# EasyEDA schematic Easy EDA - Maltron_S_Edition - Schematic.json
TITLE: Maltron_S_Edition; REV: 1.0; Date: 2022-05-24; Sheet: 1/1; Company: MindrustUK
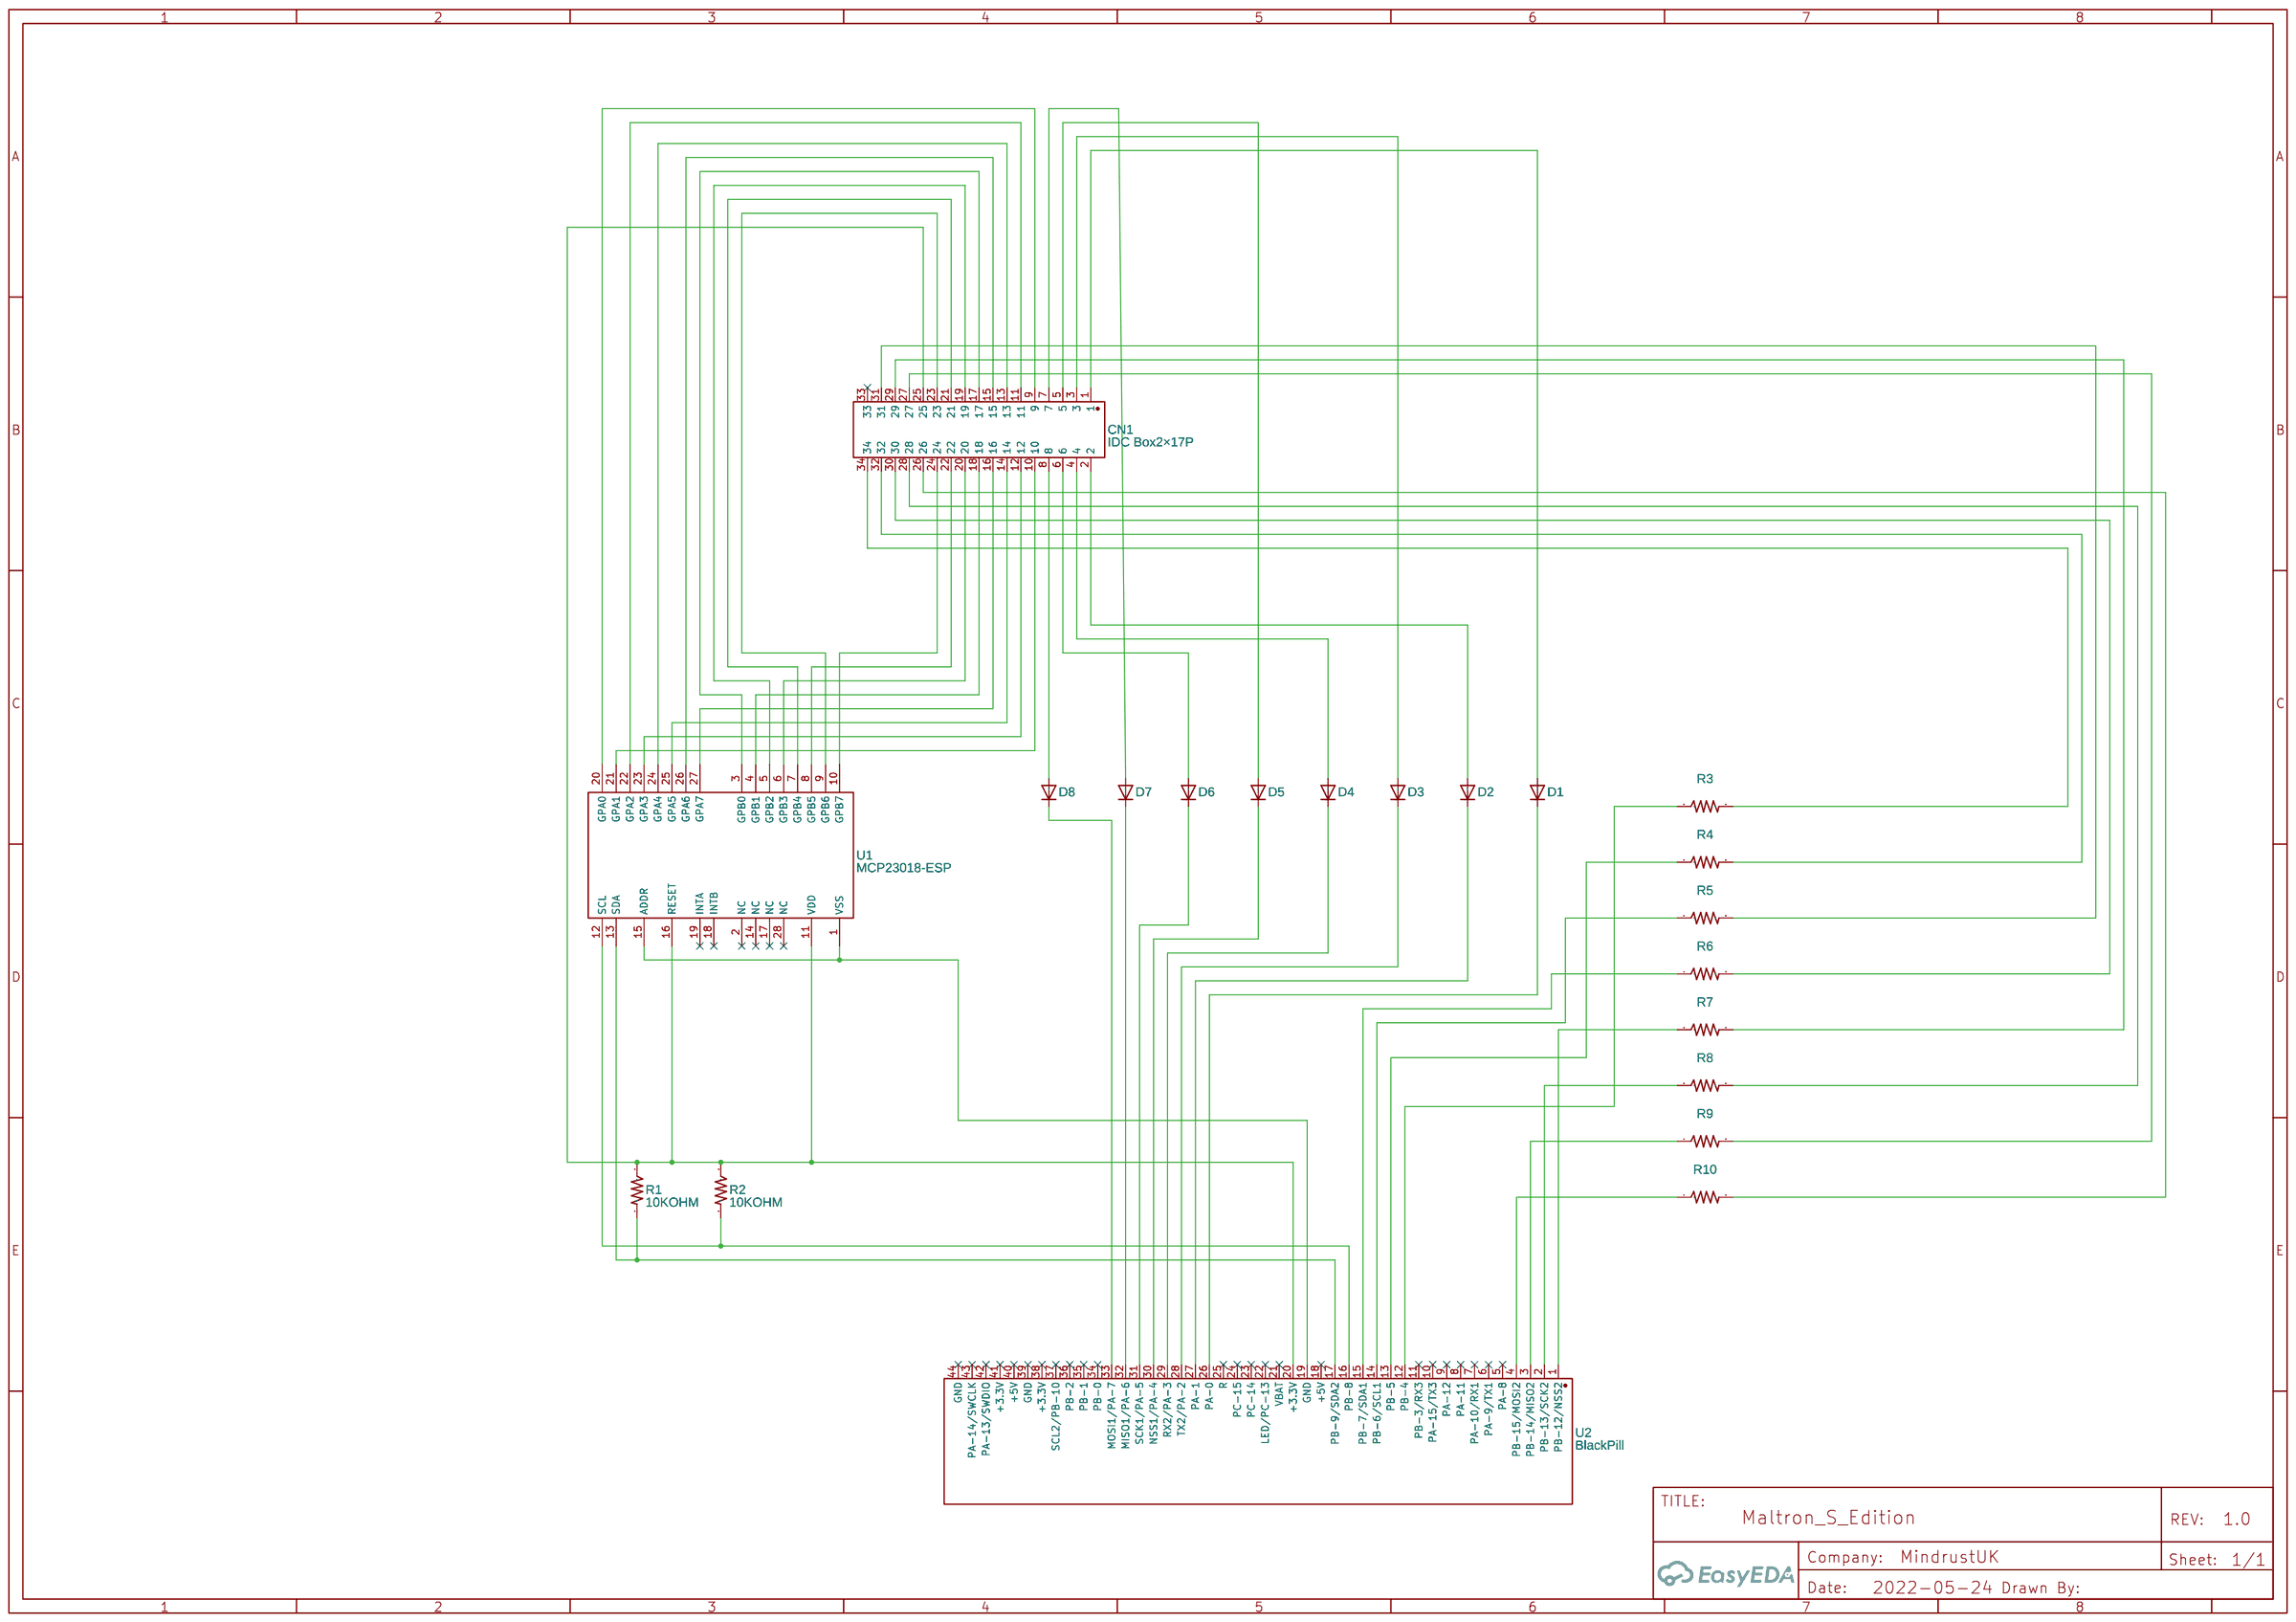
[diagram p0: schematic sheet]

## Parts
CN1  IDC Box2×17P  [IDC-TH_34P-P2.54_BOOMELE-2X17P]
D1  DIODE  [DO-1N4148]
D2  DIODE  [DO-1N4148]
D3  DIODE  [DO-1N4148]
D4  DIODE  [DO-1N4148]
D5  DIODE  [DO-1N4148]
D6  DIODE  [DO-1N4148]
D7  DIODE  [DO-1N4148]
D8  DIODE  [DO-1N4148]
R1  10KOHM  [AXIAL-0.3EZ]
R2  10KOHM  [AXIAL-0.3EZ]
R3  10OHM-1_4W-5%(PTH)HORIZ-KIT  [AXIAL-0.3EZ]
R4  10OHM-1_4W-5%(PTH)HORIZ-KIT  [AXIAL-0.3EZ]
R5  10OHM-1_4W-5%(PTH)HORIZ-KIT  [AXIAL-0.3EZ]
R6  10OHM-1_4W-5%(PTH)HORIZ-KIT  [AXIAL-0.3EZ]
R7  10OHM-1_4W-5%(PTH)HORIZ-KIT  [AXIAL-0.3EZ]
R8  10OHM-1_4W-5%(PTH)HORIZ-KIT  [AXIAL-0.3EZ]
R9  10OHM-1_4W-5%(PTH)HORIZ-KIT  [AXIAL-0.3EZ]
R10  10OHM-1_4W-5%(PTH)HORIZ-KIT  [AXIAL-0.3EZ]
U1  MCP23018-ESP  [DIP28]
U2  BlackPill  [BLACKPILL]

## Library data of the parts
CN1 = IDC Box2×17P: Supplier: LCSC; Manufacturer: BOOMELE; Manufacturer Part: IDC Box2×17P Right Angle; Supplier Part: C20920; JLCPCB Part Class: Extended Part
D1-D8 = DIODE: Contributor: Adafruit
R1 R2 = 10KOHM-1_4W5%(PTH)HORIZ-KIT: RES-09435; Contributor: SparkFun
R3-R10 = 10OHM-1_4W-5%(PTH)HORIZ-KIT: RES-10698; Contributor: SparkFun
U1 = MCP23018-ESP: 8-Bit IO Expander with Open-Drain Outputs, High-Speed I2C Interface, 28-Pin SPDIP, Extended Temperature
U2 = BlackPill: Contributor: Michael Schramm

## Nets
Net-(CN1-1): CN1.1 D1.A
Net-(CN1-2): CN1.2 D2.A
Net-(CN1-3): CN1.3 D3.A
Net-(CN1-4): CN1.4 D4.A
Net-(CN1-5): CN1.5 D5.A
Net-(CN1-6): CN1.6 D6.A
Net-(CN1-7): CN1.7 D7.A
Net-(CN1-8): CN1.8 D8.A
Net-(CN1-9): CN1.9 U1.20(GPA0)
Net-(CN1-10): CN1.10 U1.21(GPA1)
Net-(CN1-11): CN1.11 U1.22(GPA2)
Net-(CN1-12): CN1.12 U1.23(GPA3)
Net-(CN1-13): CN1.13 U1.24(GPA4)
Net-(CN1-14): CN1.14 U1.25(GPA5)
Net-(CN1-15): CN1.15 U1.26(GPA6)
Net-(CN1-16): CN1.16 U1.27(GPA7)
Net-(CN1-17): CN1.17 U1.3(GPB0)
Net-(CN1-18): CN1.18 U1.4(GPB1)
Net-(CN1-19): CN1.19 U1.5(GPB2)
Net-(CN1-20): CN1.20 U1.6(GPB3)
Net-(CN1-21): CN1.21 U1.7(GPB4)
Net-(CN1-22): CN1.22 U1.8(GPB5)
Net-(CN1-23): CN1.23 U1.9(GPB6)
Net-(CN1-24): CN1.24 U1.10(GPB7)
Net-(CN1-25): CN1.25 R1.1 R2.1 U1.11(VDD) U1.16(RESET) U2.20(+3.3V)
Net-(CN1-26): CN1.26 R10.2
Net-(CN1-27): CN1.27 R9.2
Net-(CN1-28): CN1.28 R8.2
Net-(CN1-29): CN1.29 R7.2
Net-(CN1-30): CN1.30 R6.2
Net-(CN1-31): CN1.31 R5.2
Net-(CN1-32): CN1.32 R4.2
Net-(CN1-34): CN1.34 R3.2
Net-(D1-C): D1.C U2.26(PA-0)
Net-(D2-C): D2.C U2.27(PA-1)
Net-(D3-C): D3.C U2.28(TX2/PA-2)
Net-(D4-C): D4.C U2.29(RX2/PA-3)
Net-(D5-C): D5.C U2.30(NSS1/PA-4)
Net-(D6-C): D6.C U2.31(SCK1/PA-5)
Net-(D7-C): D7.C U2.32(MISO1/PA-6)
Net-(D8-C): D8.C U2.33(MOSI1/PA-7)
Net-(R1-2): R1.2 U1.13(SDA) U2.17(PB-9/SDA2)
Net-(R2-2): R2.2 U1.12(SCL) U2.16(PB-8)
Net-(R3-1): R3.1 U2.12(PB-4)
Net-(R4-1): R4.1 U2.13(PB-5)
Net-(R5-1): R5.1 U2.14(PB-6/SCL1)
Net-(R6-1): R6.1 U2.15(PB-7/SDA1)
Net-(R7-1): R7.1 U2.1(PB-12/NSS2)
Net-(R8-1): R8.1 U2.2(PB-13/SCK2)
Net-(R9-1): R9.1 U2.3(PB-14/MISO2)
Net-(R10-1): R10.1 U2.4(PB-15/MOSI2)
Net-(U1-1): U1.1(VSS) U1.15(ADDR) U2.19(GND)

Not connected (* = marked no-connect by the designer): CN1 33*; U1 2(NC)* 14(NC)* 17(NC)* 18(INTB)* 19(INTA)* 28(NC)*; U2 5(PA-8)* 6(PA-9/TX1)* 7(PA-10/RX1)* 8(PA-11)* 9(PA-12)* 10(PA-15/TX3)* 11(PB-3/RX3)* 18(+5V)* 21(VBAT)* 22(LED/PC-13)* 23(PC-14)* 24(PC-15)* 25(R)* 34(PB-0)* 35(PB-1)* 36(PB-2)* 37(SCL2/PB-10)* 38(+3.3V)* 39(GND)* 40(+5V)* 41(+3.3V)* 42(PA-13/SWDIO)* 43(PA-14/SWCLK)* 44(GND)*
